# EAGLE design 04C-004 Adjustable Analog Front End (EAGLE 6.3)

## Sheet 1 of 5
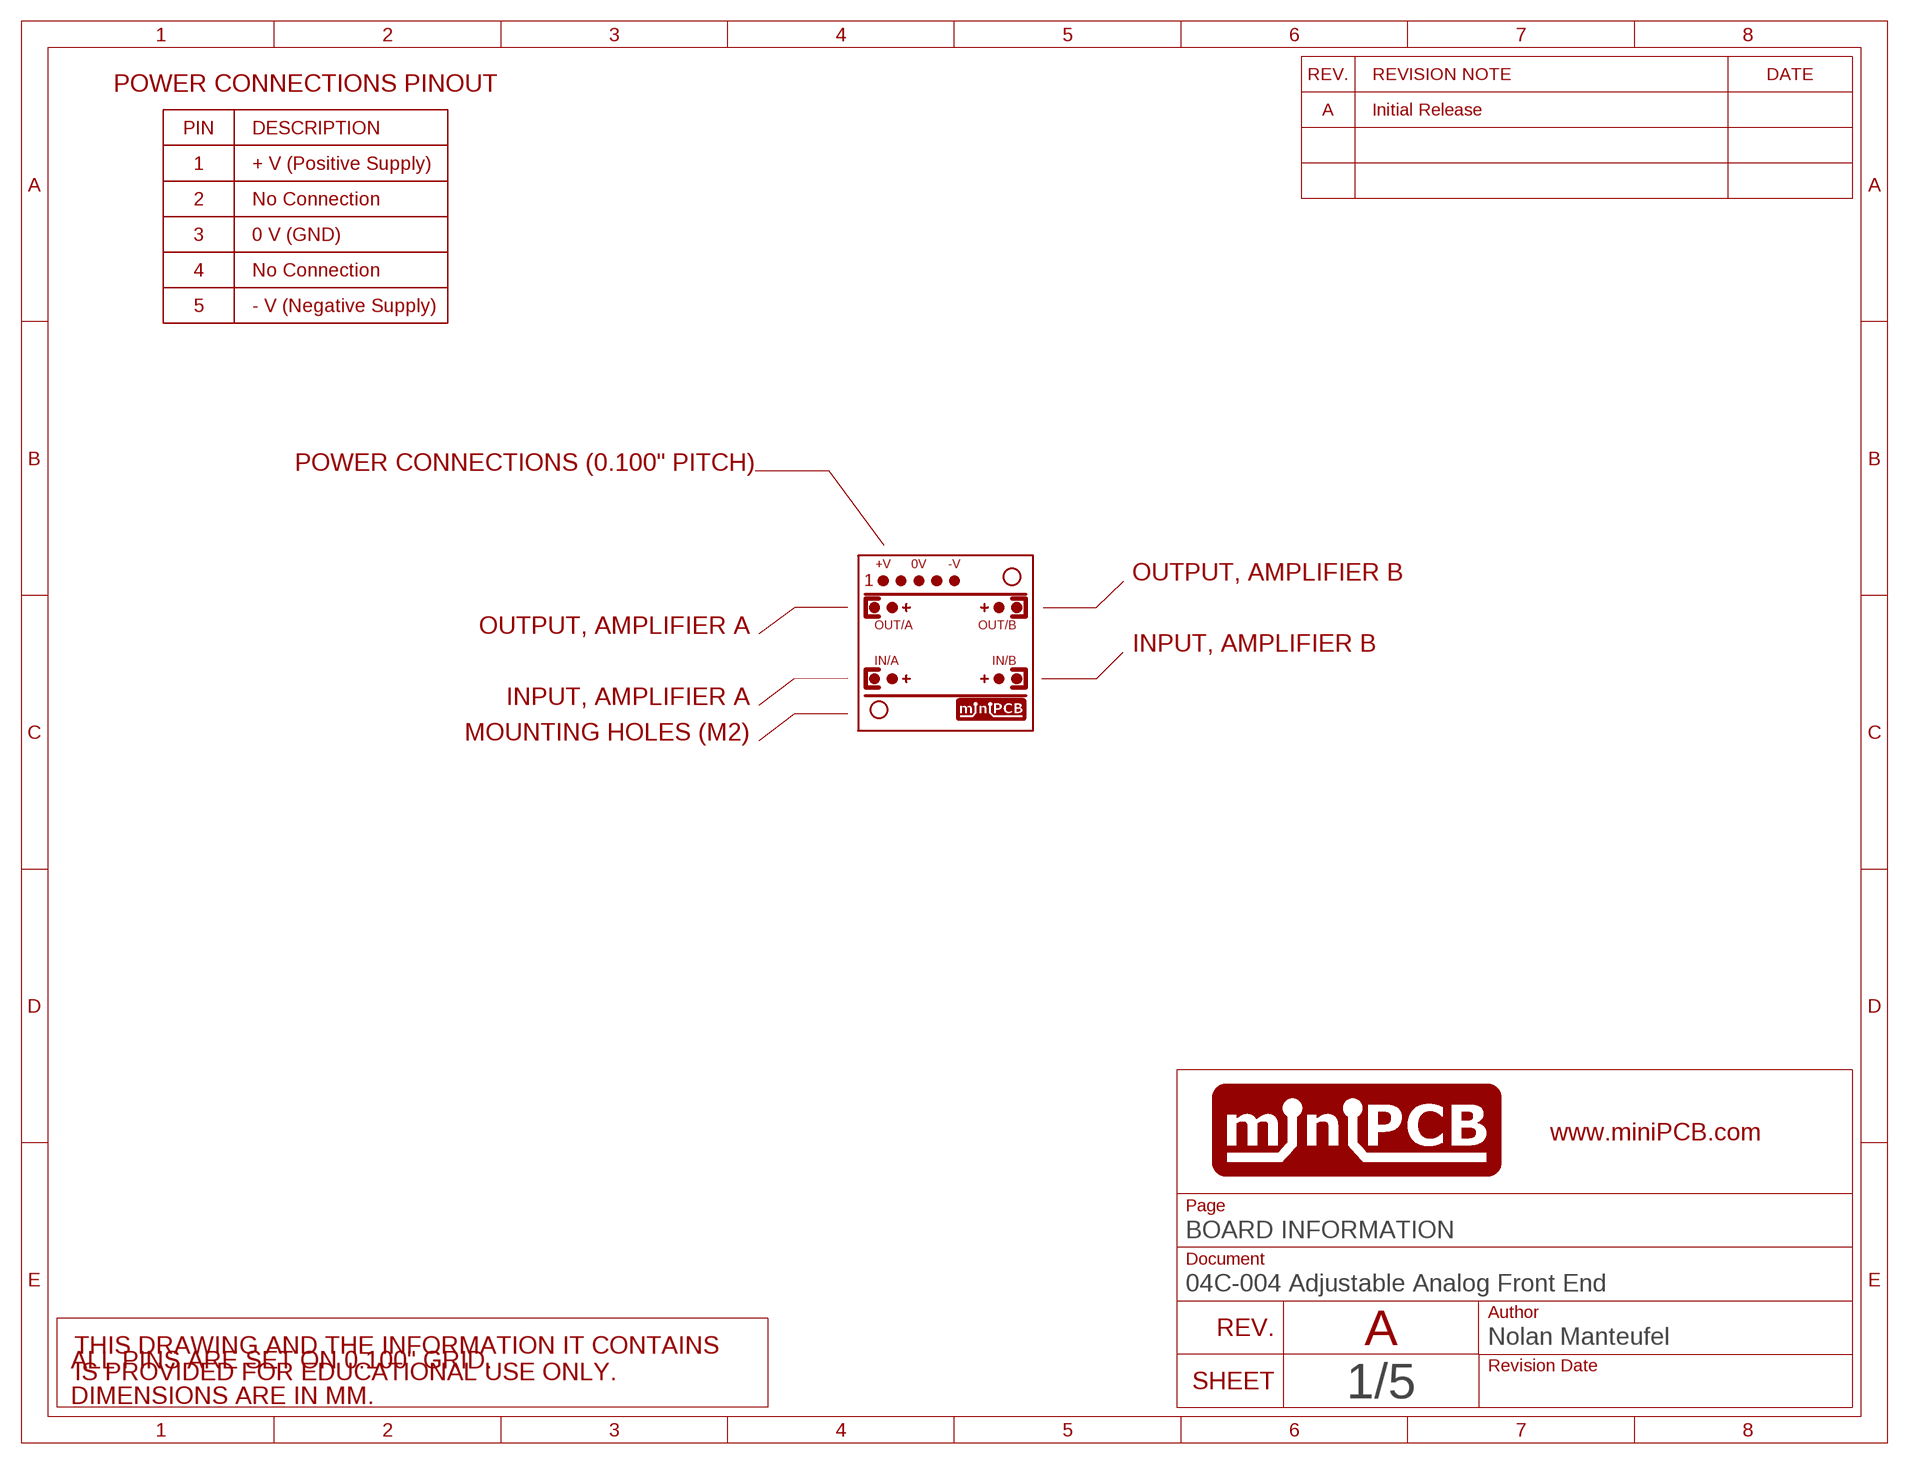
[diagram p0: schematic, sheet 1]

### Notes on the sheet
- A

## Sheet 2 of 5
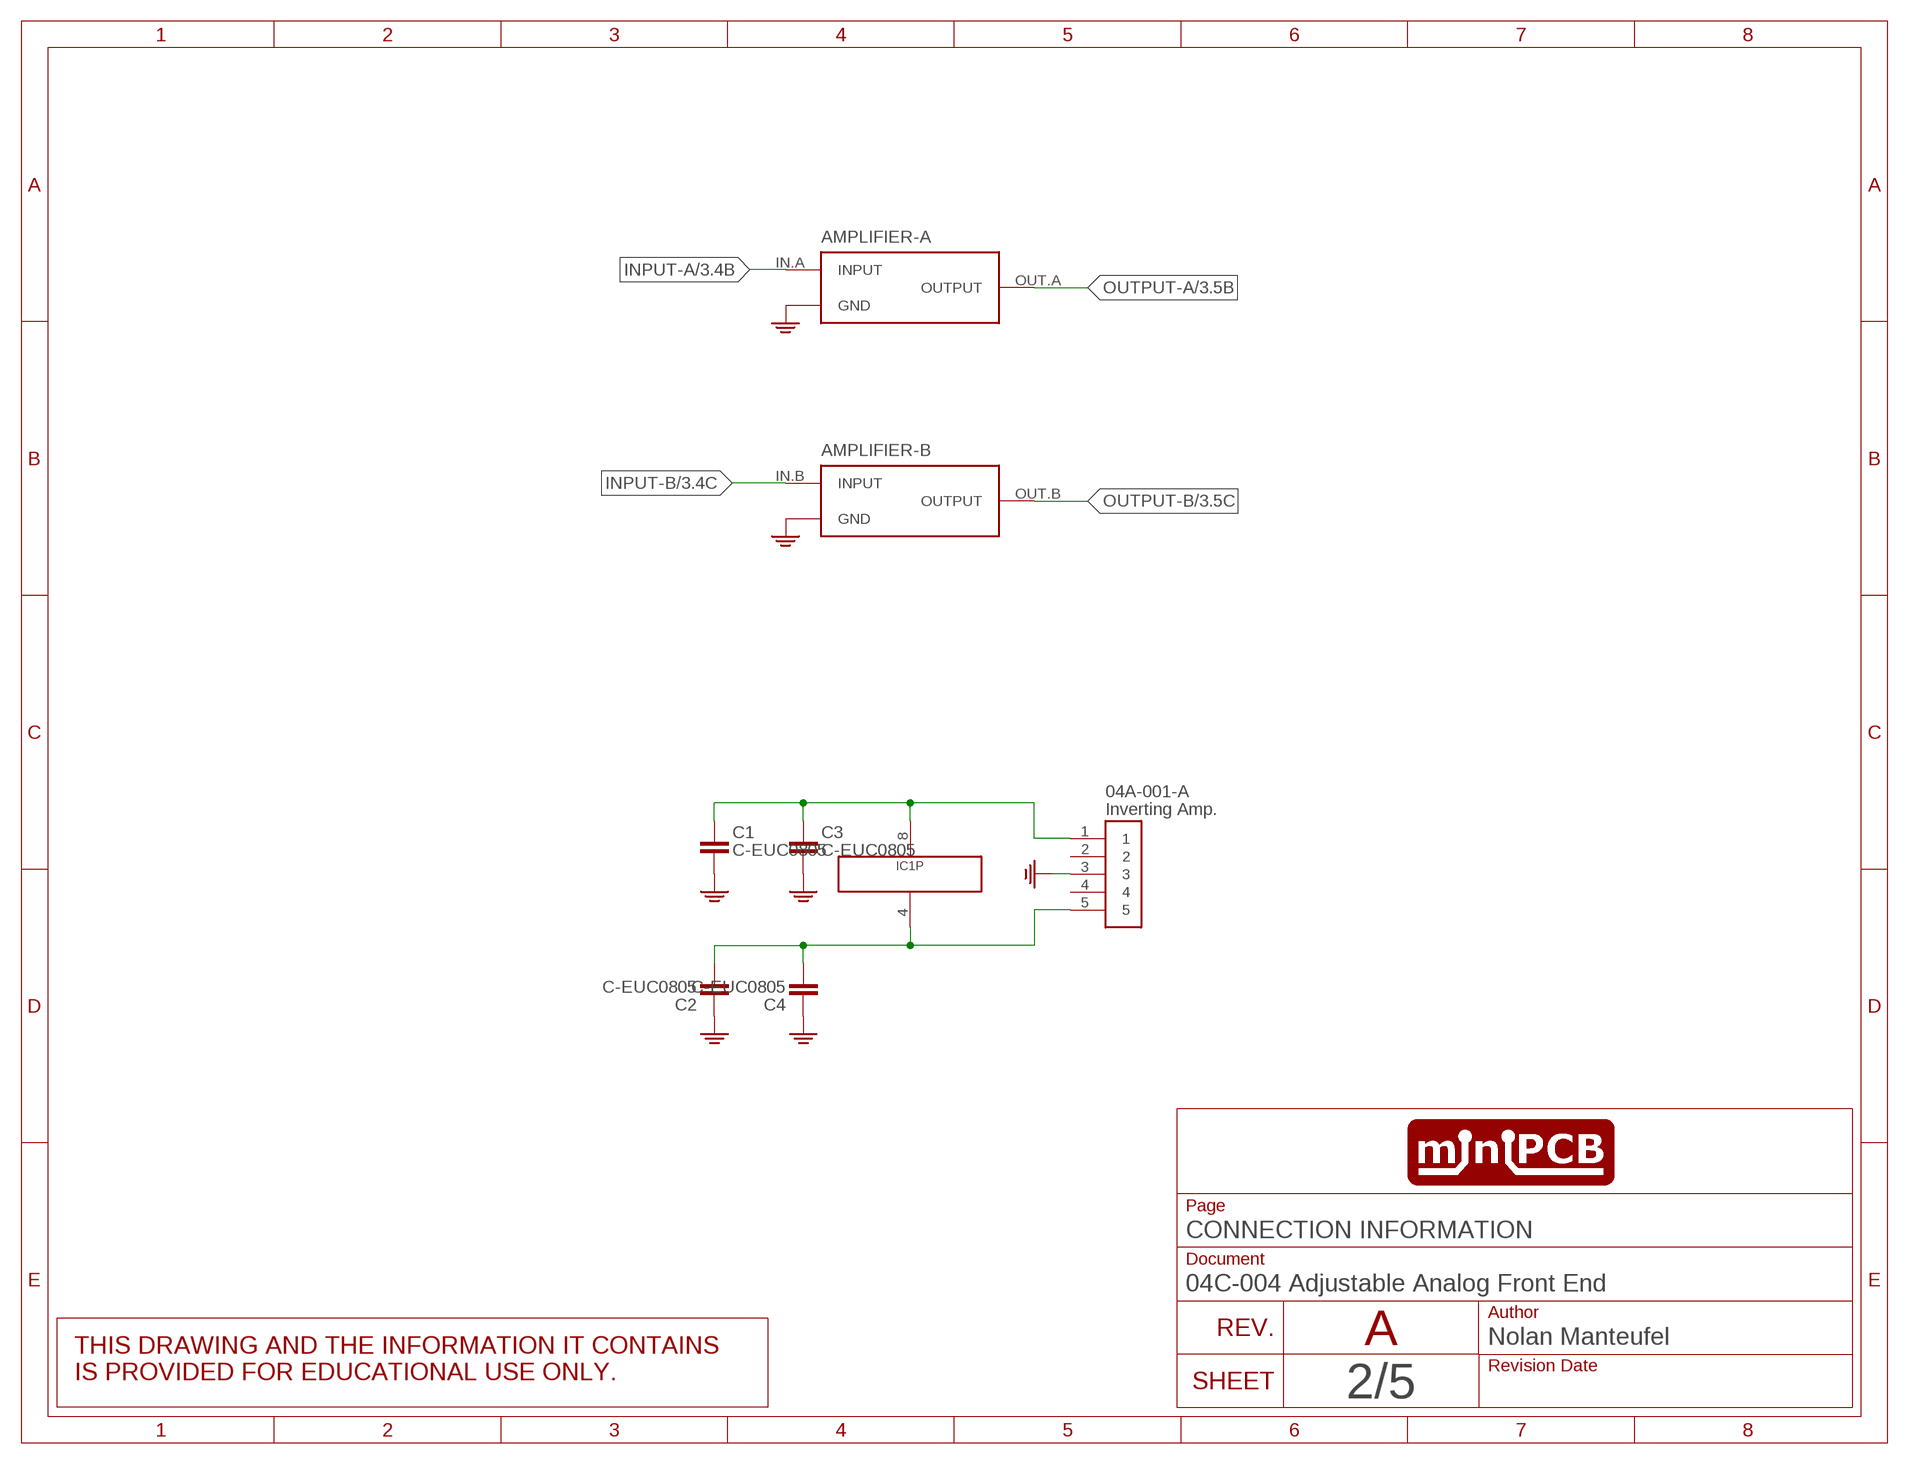
[diagram p1: schematic, sheet 2]

### Parts
04A-001-A  Inverting Amp.  MINIPCB_5P25MM  [MINIPCB_25X25MM]
AMPLIFIER-  MINIPCB_AMP-DUAL25-T  [MINIPCB_25MM-AMP-DUAL-VTEXT]
C1  C-EUC0805  [C0805]
C2  C-EUC0805  [C0805]
C3  C-EUC0805  [C0805]
C4  C-EUC0805  [C0805]
IC1  LF412D  [SO08]

### Nets
GND: 04A-001-A.3 AMPLIFIER-.GND.A1(A:GND) AMPLIFIER-.GND.A2(A:GND) AMPLIFIER-.GND.B1(B:GND) AMPLIFIER-.GND.B2(B:GND) C1.2 C2.1 C3.2 C4.1 ; also sheet 3
INPUT-A: AMPLIFIER-.IN.A(A:INPUT) ; also sheet 3
INPUT-B: AMPLIFIER-.IN.B(B:INPUT) ; also sheet 3
N$17: 04A-001-A.1 C1.1 C3.1 IC1.8(P:V+)
N$18: 04A-001-A.5 C2.2 C4.2 IC1.4(P:V-)
OUTPUT-A: AMPLIFIER-.OUT.A(A:OUTPUT) ; also sheet 3
OUTPUT-B: AMPLIFIER-.OUT.B(B:OUTPUT) ; also sheet 3
Unconnected: 04A-001-A.2 04A-001-A.4

### Notes on the sheet
- A

## Sheet 3 of 5
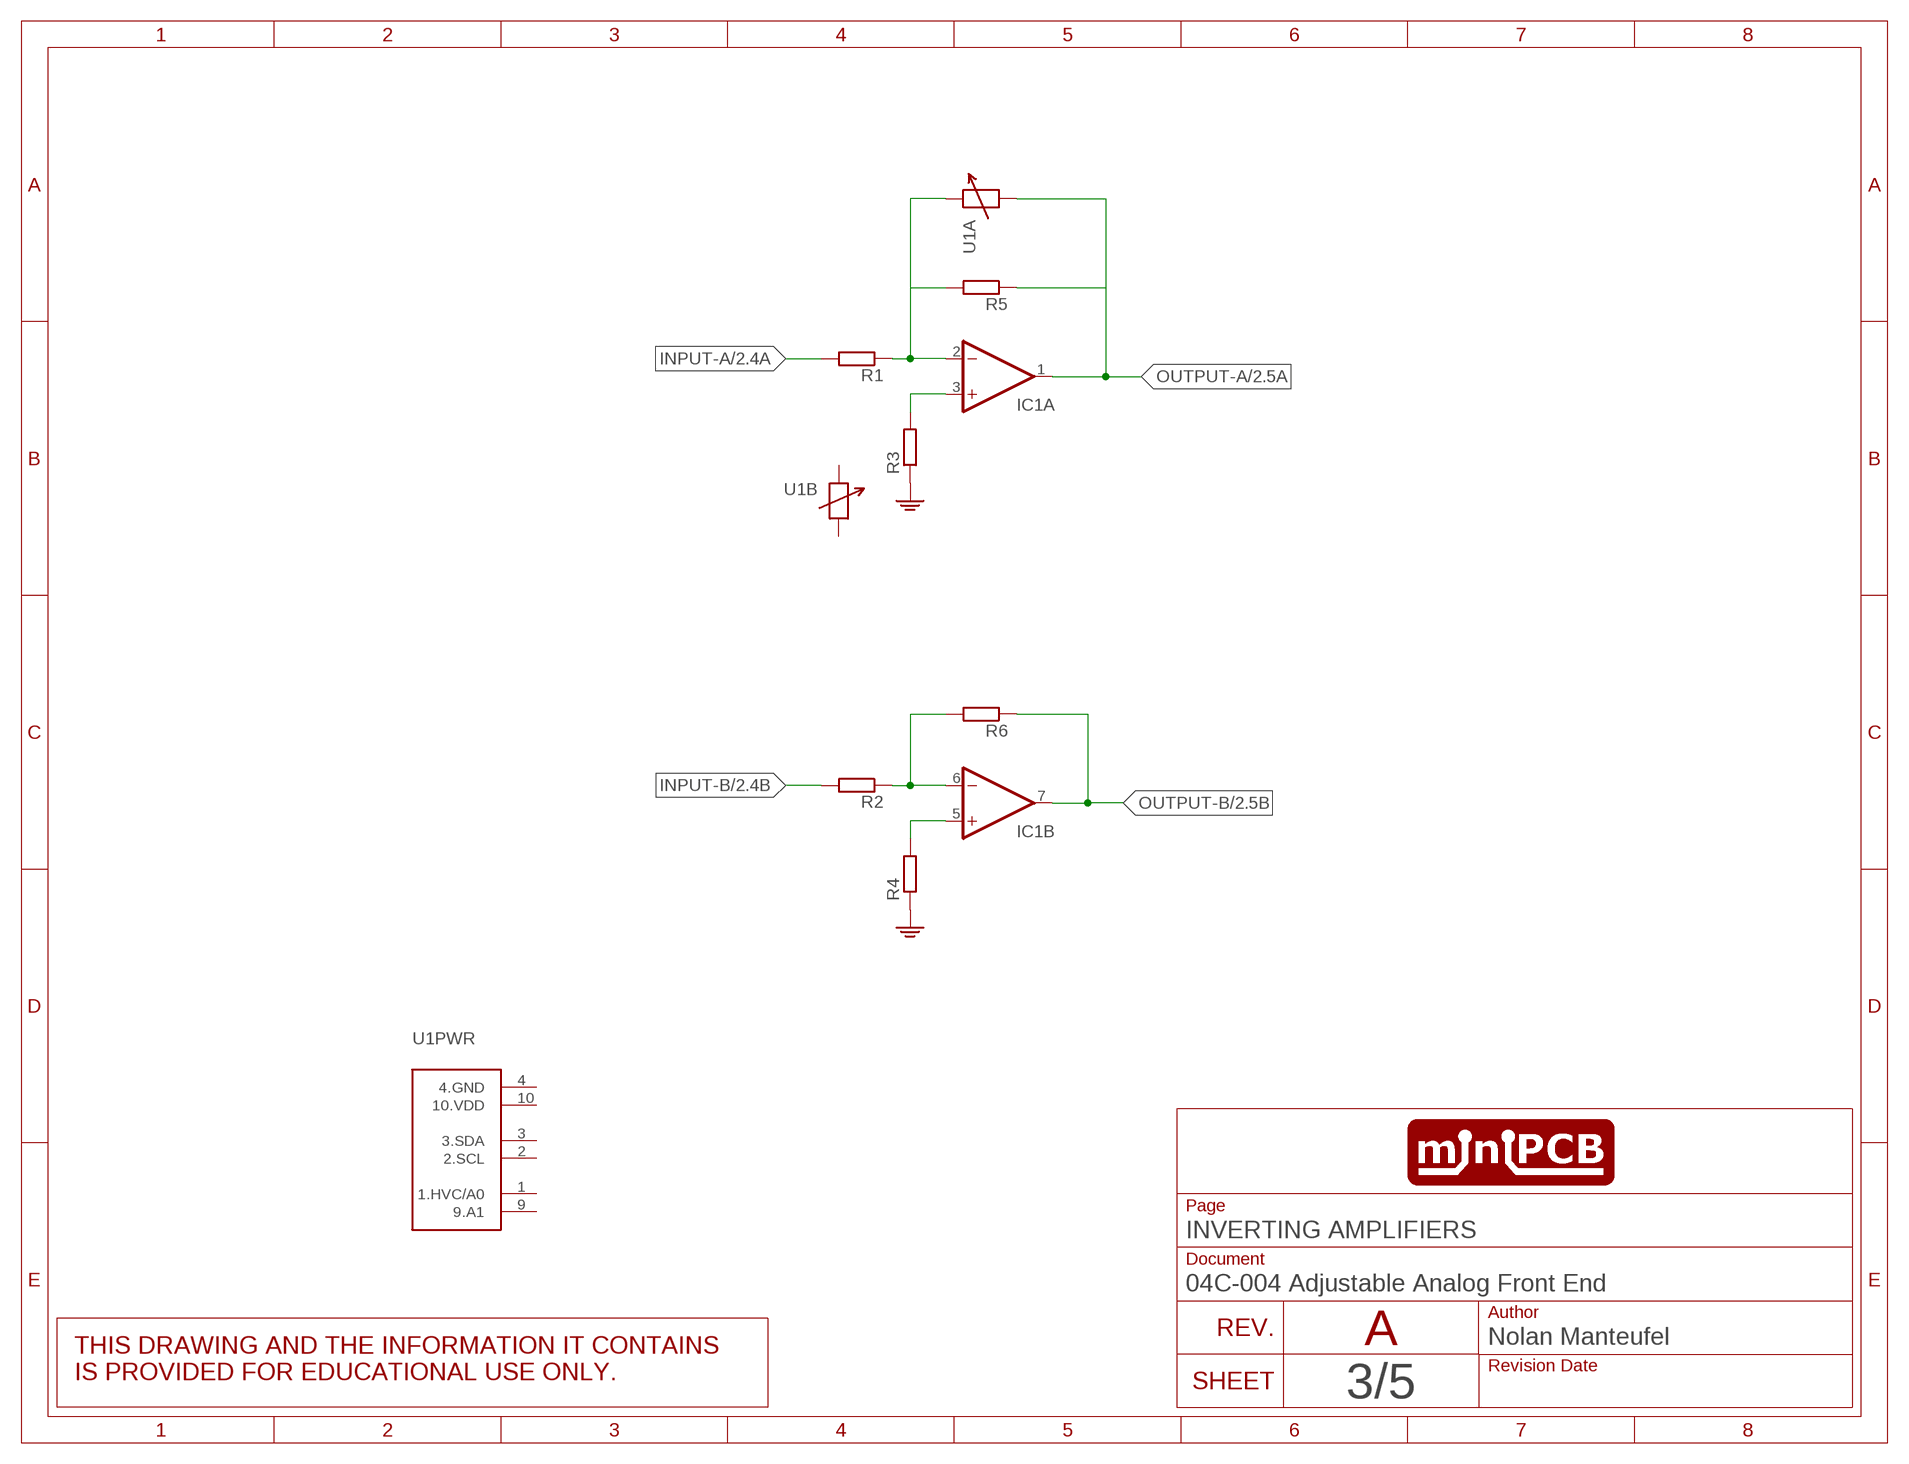
[diagram p2: schematic, sheet 3]

### Parts
R1  R-EU_R0805  [R0805]
R2  R-EU_R0805  [R0805]
R3  R-EU_R0805  [R0805]
R4  R-EU_R0805  [R0805]
R5  R-EU_R0805  [R0805]
R6  R-EU_R0805  [R0805]
U1  MCP4542T  [MMSOP10]

### Nets
GND: R3.1 R4.1 ; also sheet 2
INPUT-A: R1.2 ; also sheet 2
INPUT-B: R2.2 ; also sheet 2
N$1: IC1.5(B:+IN) R4.2
N$2: IC1.6(B:-IN) R2.1 R6.2
N$10: IC1.3(A:+IN) R3.2
N$11: IC1.2(A:-IN) R1.1 R5.2 U1.8(A:B)
OUTPUT-A: IC1.1(A:OUT) R5.1 U1.7(A:W) ; also sheet 2
OUTPUT-B: IC1.7(B:OUT) R6.1 ; also sheet 2
Unconnected: U1.1(PWR:1.HVC/A0) U1.2(PWR:2.SCL) U1.3(PWR:3.SDA) U1.4(PWR:4.GND) U1.5(B:B) U1.6(B:W) U1.9(PWR:9.A1) U1.10(PWR:10.VDD)

### Notes on the sheet
- A

## Sheet 4 of 5
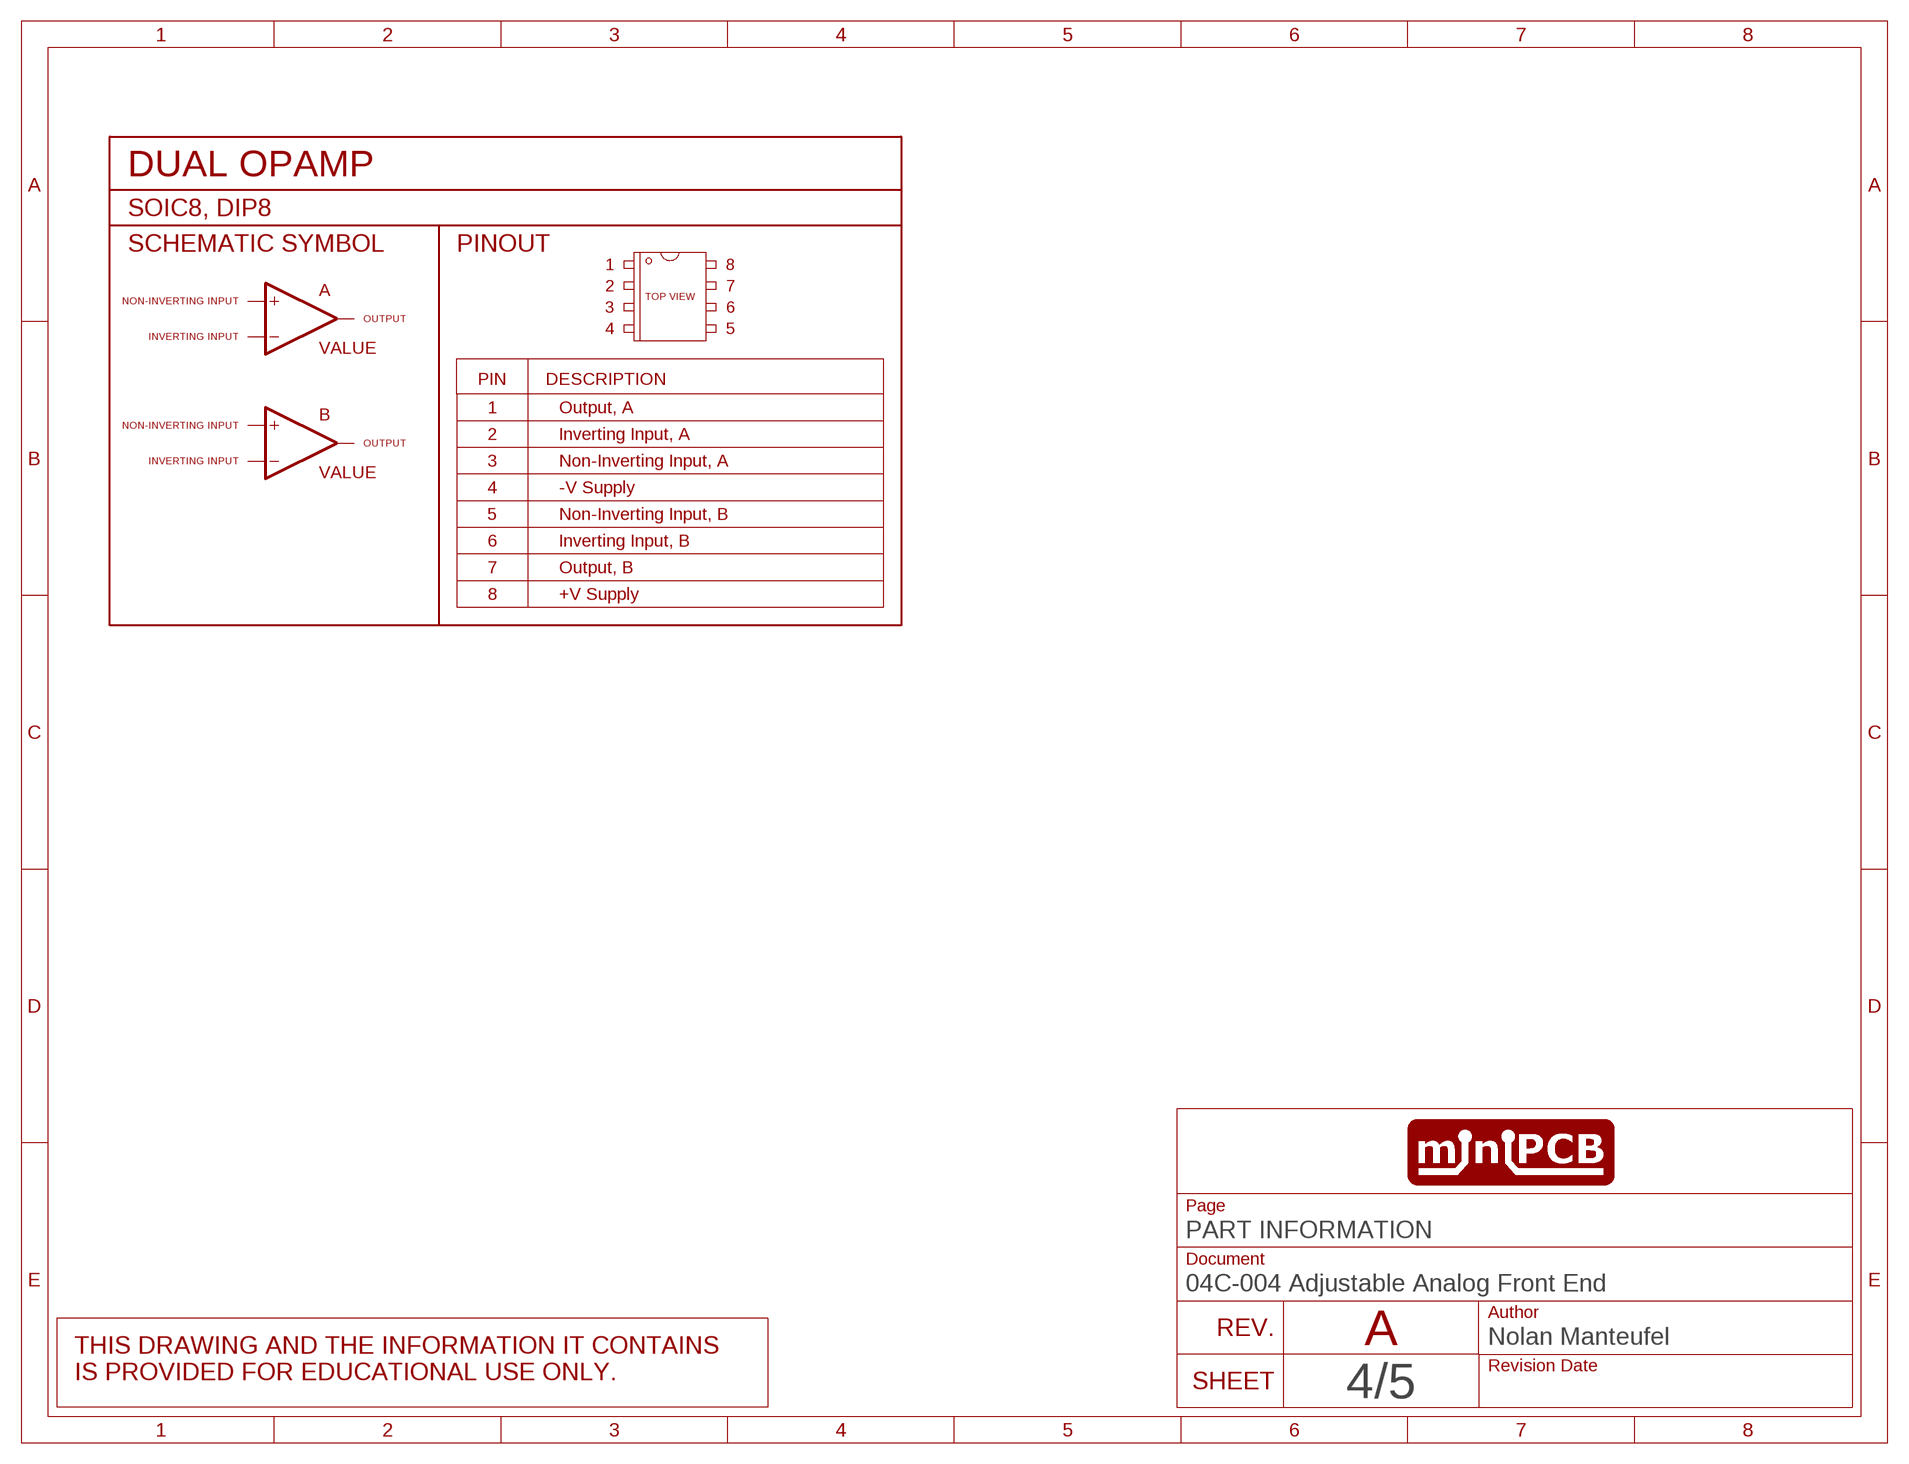
[diagram p3: schematic, sheet 4]

### Notes on the sheet
- A

## Sheet 5 of 5
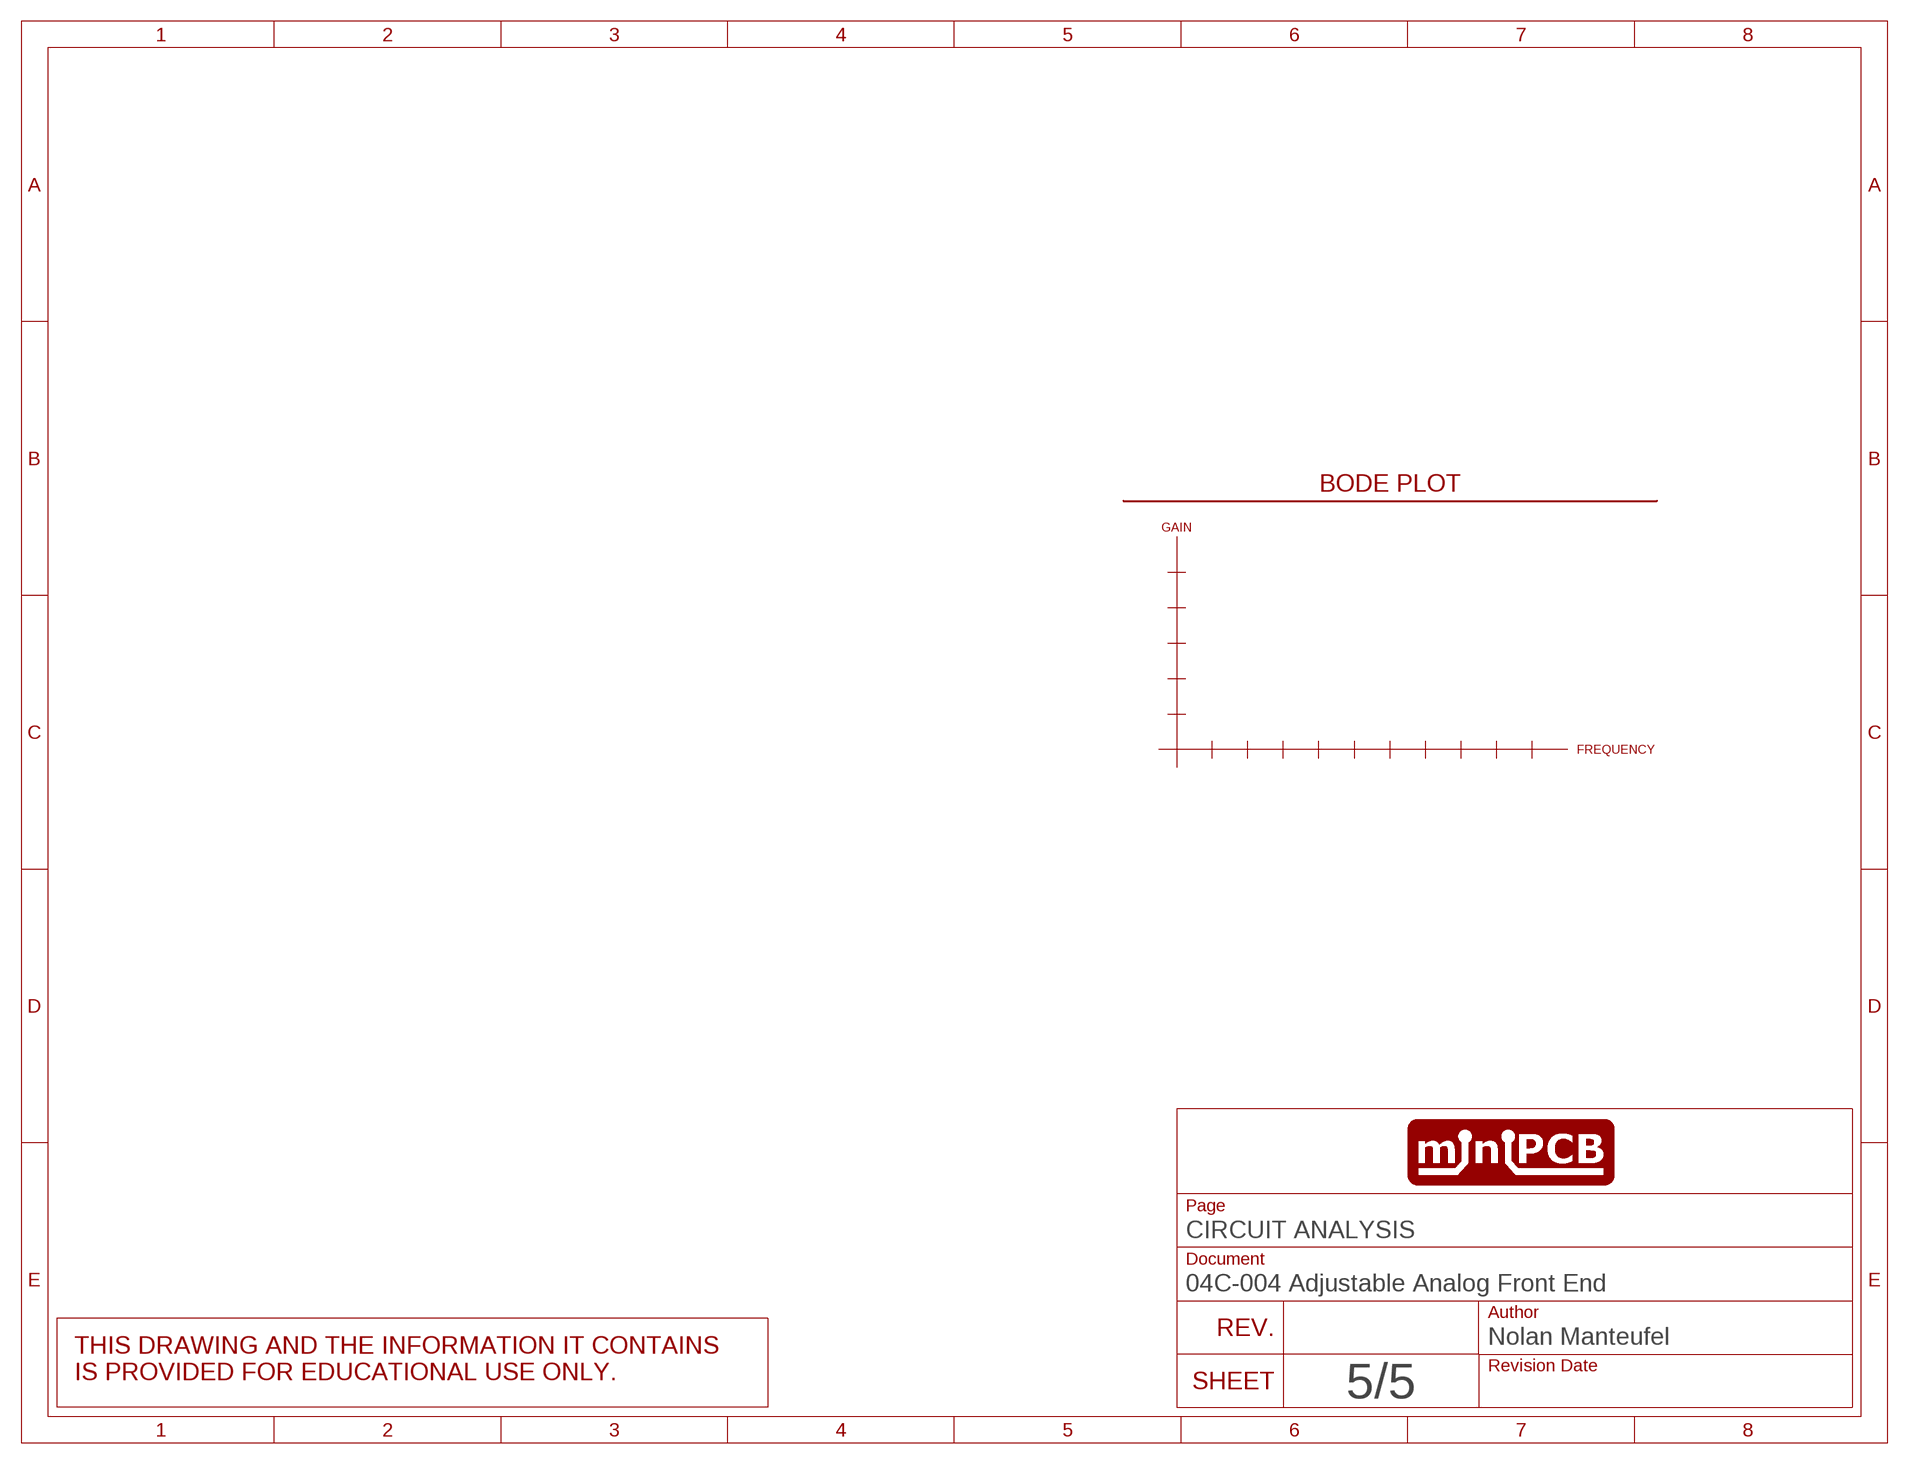
[diagram p4: schematic, sheet 5]

## Library data of the parts
04A-001-A = nolan-utsa:MINIPCB_5P
AMPLIFIER- = nolan-utsa:MINIPCB_AMP-DUAL
C1-C4 = nolan-utsa:C-EU: CAPACITOR, European symbol
IC1 = nolan-utsa:LF412: OP AMP
R1-R6 = nolan-utsa:R-EU_: RESISTOR, European symbol
U1 = nolan:MCP4542

## Board
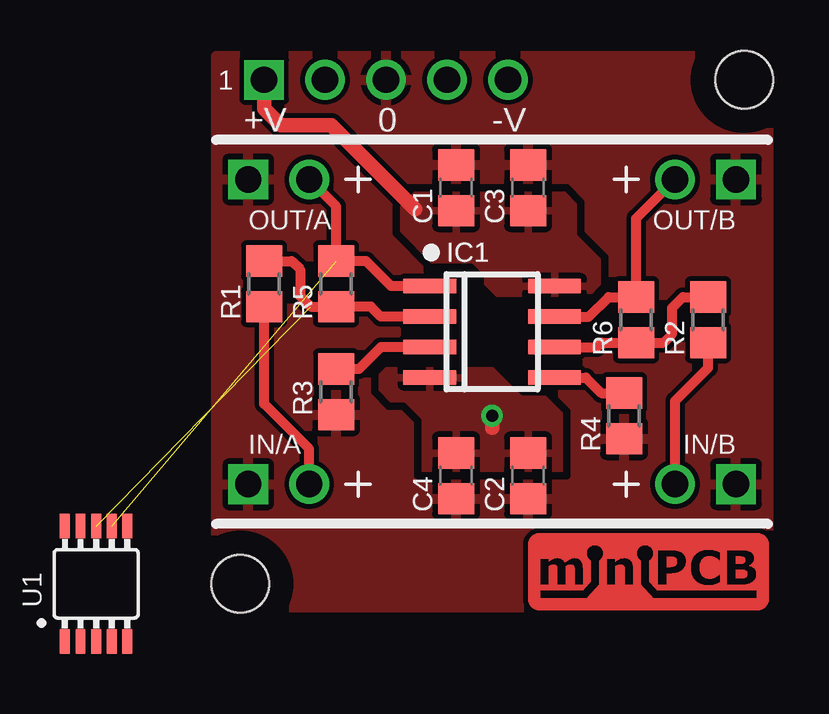
[diagram p5: board, top side]
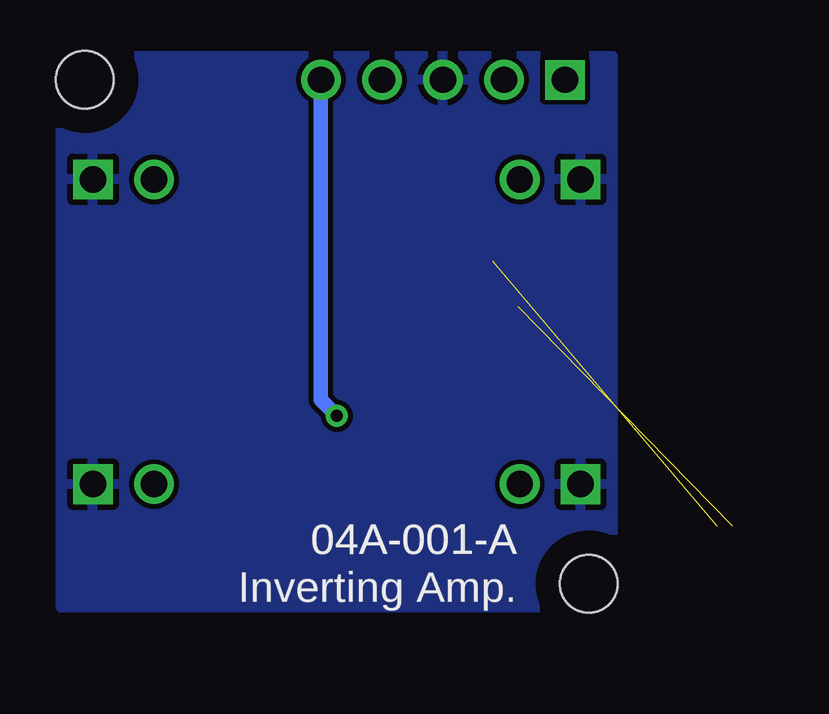
[diagram p6: board, bottom side, seen from below]

No outline drawn. Coordinates in mm, seen from the top.
Copper layers (1*16): Top 0.035mm / dielectric 1.5mm / Bottom 0.035mm
Design rules "default": minimum track width 10mil, minimum drill 24mil, track to track 8mil, track to pad 8mil, pad to pad 8mil, via to via 8mil, smd to smd 8mil, copper to edge 40mil, drill to drill 8mil, minimum pad ring 10mil, minimum via ring 8mil, stop-mask expansion 4mil, vias tented up to drill 0mil, thermal gap 10mil
tRestrict: 26 lines

### Footprints (pad centres in the part's own frame; a part is rotated, then mirrored left to right if it is on the bottom)
MINIPCB_25X25MM = drill 1.1 square: 1 3,23 | drill 1.1: 2 5.54,23; 3 8.08,23; 4 10.62,23; 5 13.16,23 | hole 2.4: 23,23; 2,2
MINIPCB_25MM-AMP-DUAL-VTEXT = drill 1.1 square: GND.A1 -10.16,-6.35; GND.A2 -10.16,6.35; GND.B1 10.16,-6.35; GND.B2 10.16,6.35 | drill 1.1: IN.A -7.62,-6.35; IN.B 7.62,-6.35; OUT.A -7.62,6.35; OUT.B 7.62,6.35
C0805 = smd 1.3 x 1.5: 1 -0.95,0; 2 0.95,0
SO08 = smd 0.6 x 2.2: 1 -1.905,-2.6; 2 -0.635,-2.6; 3 0.635,-2.6; 4 1.905,-2.6; 5 1.905,2.6; 6 0.635,2.6; 7 -0.635,2.6; 8 -1.905,2.6
R0805 = smd 1.3 x 1.5: 1 -0.95,0; 2 0.95,0
MMSOP10 = smd 0.41 x 1.02: 1 -1.3,-2.4; 2 -0.65,-2.4; 3 0,-2.4; 4 0.65,-2.4; 5 1.3,-2.4; 6 1.3,2.4; 7 0.65,2.4; 8 0,2.4; 9 -0.65,2.4; 10 -1.3,2.4

### Placement (x,y rotation side)
04A-001-A  0,0 0 top
AMPLIFIER-  12.5,12.5 0 top
C1  11,18.5 90 top
C2  14,6.5 90 top
C3  14,18.5 90 top
C4  11,6.5 90 top
IC1  12.5,12.5 270 top
R1  3,14.5 270 top
R2  21.5,13 270 top
R3  6,10 90 top
R4  18,9 90 top
R5  6,14.5 270 top
R6  18.5,13 270 top
U1  -4,2 0 top

### Tracks (layer width: path | path; a pad name or v marks a point on that pad's centre or on a via)
GND
  pour Bottom: 1,1 24,1 24,24 1,24
  pour Top: 24,1 1,1 1,24 24,24
INPUT-A
  Top 0.406: AMPLIFIER-.IN.A 4.88,7.62 3,9.5 R1.2
INPUT-B
  Top 0.406: R2.2 21.5,11 20.12,9.62 AMPLIFIER-.IN.B
N$1
  Top 0.406: IC1.5 16.41,10.6 17.05,9.95 R4.2
N$2
  Top 0.406: IC1.6 16.86,11.87 17.05,12.05 R6.2 19.65,12.05 20,12.4 20,13.5 20.45,13.95 R2.1
N$10
  Top 0.406: IC1.3 7.87,11.87 6.95,10.95 R3.2
N$11  (1 unrouted)
  Top 0.406: IC1.2 7.87,13.13 7.45,13.55 R5.2 4.95,13.55 4.5,14 4.5,15.1 4.15,15.45 R1.1
N$17
  Top 0.61: 04A-001-A.1 3,21.8 3.7,21.1 5.8,21.1 9.3,17.6
  pour Top: 8.5,17.8 9.2,18.5 15.6,18.5 16.2,17.9 16.2,16.6 17.2,15.6 17.2,14.4 16.6,13.8 12.6,13.8 12,14.4 12,14.8 11.6,15.2 9.9,15.2 8.5,16.6
N$18  (via drill 0.5)
  Top 0.61: v12.5,9 12.5,8.5
  Bottom 0.61: 04A-001-A.5 13.16,9.66 v12.5,9
  pour Top: 7.6,10.8 8,11.2 12.6,11.2 13.8,10 14.8,10 15.6,9.2 15.6,6.5 9.4,6.5 9.4,8.8 8.8,9.4 8.2,9.4 7.6,10
OUTPUT-A  (1 unrouted)
  Top 0.406: IC1.1 8.29,14.4 7.25,15.45 R5.1 6,17.73 AMPLIFIER-.OUT.A
OUTPUT-B
  Top 0.406: IC1.7 16.54,13.13 17.35,13.95 R6.1 18.5,17.23 AMPLIFIER-.OUT.B

### Text on the board
_tNames: C1 | C3 | IC1 | R1 | R5 | R6 | R2 | R3 | R4 | C4 | C2
_bNames: 04A-001-A